# Altium schematic sheet CONNECTIONS.SchDoc: CONNECTIONS
size A4; DocumentNumber: 7; Revision: 1.9; SheetNumber: 7; SheetTotal: 18
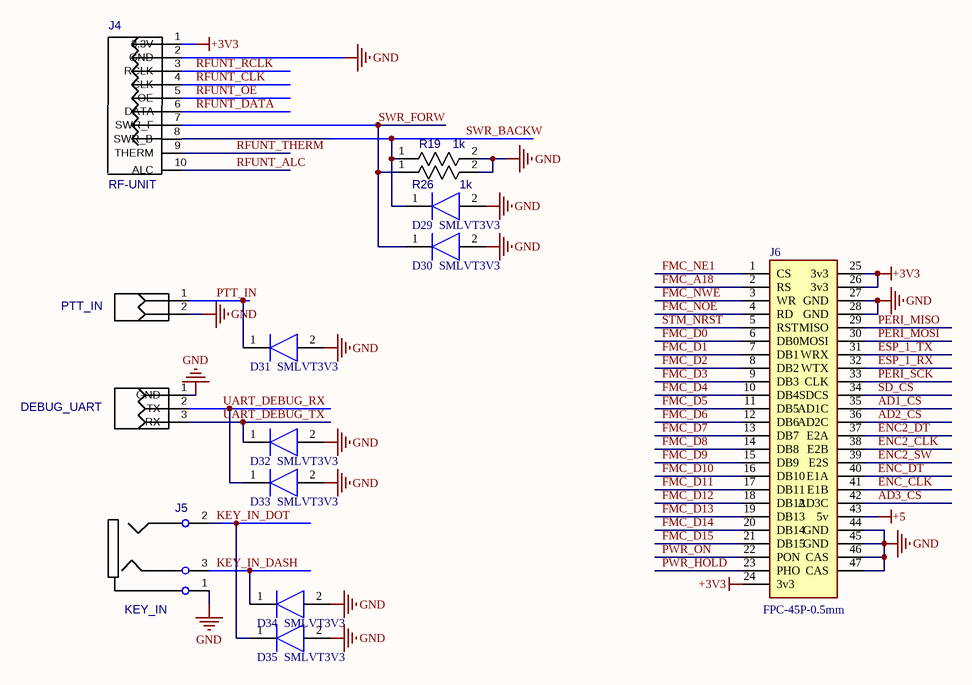
[diagram p0: CONNECTIONS.SchDoc]

## Parts
D29  SMLVT3V3  [SMBJ36CATR]
D30  SMLVT3V3  [SMBJ36CATR]
D31  SMLVT3V3  [SMBJ36CATR]
D32  SMLVT3V3  [SMBJ36CATR]
D33  SMLVT3V3  [SMBJ36CATR]
D34  SMLVT3V3  [SMBJ36CATR]
D35  SMLVT3V3  [SMBJ36CATR]
DEBUG_UART  DEBUG_UART  [51022-0300]  (value not drawn)
J4  RF-UNIT  [90131-0126]
J5  value KEY_IN  [SJ1-3523N]  (hidden comment: SJ1-3523N)
J6  FPC-45P-0.5mm  [FH12S45S05SH60]
PTT_IN  PTT_IN  [51022-0200]  (value not drawn)
R19  1k  [RES_0805]
R26  1k  [RES_0805]

## Nets
+3V3: J4.1(3.3V) J6.24(3v3) J6.25(3v3) J6.26(3v3)
+5: J6.43(5v)
GND: D29.2(A) D30.2(A) D31.2(A) D32.2(A) D33.2(A) D34.2(A) D35.2(A) DEBUG_UART.1(GND) J4.2(GND) J5.1(sleeve) J6.27(GND) J6.28(GND) J6.44(GND) J6.45(GND) J6.46(CAS) J6.47(CAS) PTT_IN.2 R19.2 R26.2
AD1_CS: J6.35(AD1C)
AD2_CS: J6.36(AD2C)
AD3_CS: J6.42(AD3C)
ENC2_CLK: J6.38(E2B)
ENC2_DT: J6.37(E2A)
ENC2_SW: J6.39(E2S)
ENC_CLK: J6.41(E1B)
ENC_DT: J6.40(E1A)
ESP_1_RX: J6.32(WTX)
ESP_1_TX: J6.31(WRX)
FMC_A18: J6.2(RS)
FMC_D0: J6.6(DB0)
FMC_D1: J6.7(DB1)
FMC_D2: J6.8(DB2)
FMC_D3: J6.9(DB3)
FMC_D4: J6.10(DB4)
FMC_D5: J6.11(DB5)
FMC_D6: J6.12(DB6)
FMC_D7: J6.13(DB7)
FMC_D8: J6.14(DB8)
FMC_D9: J6.15(DB9)
FMC_D10: J6.16(DB10)
FMC_D11: J6.17(DB11)
FMC_D12: J6.18(DB12)
FMC_D13: J6.19(DB13)
FMC_D14: J6.20(DB14)
FMC_D15: J6.21(DB15)
FMC_NE1: J6.1(CS)
FMC_NOE: J6.4(RD)
FMC_NWE: J6.3(WR)
KEY_IN_DASH: D34.1(K) J5.3(ring)
KEY_IN_DOT: D35.1(K) J5.2(tip)
PERI_MISO: J6.29(MISO)
PERI_MOSI: J6.30(MOSI)
PERI_SCK: J6.33(CLK)
PTT_IN: D31.1(K) PTT_IN.1
PWR_HOLD: J6.23(PHO)
PWR_ON: J6.22(PON)
RFUNT_ALC: J4.10(ALC)
RFUNT_CLK: J4.4(CLK)
RFUNT_DATA: J4.6(DATA)
RFUNT_OE: J4.5(OE)
RFUNT_RCLK: J4.3(RCLK)
RFUNT_THERM: J4.9(THERM)
SD_CS: J6.34(SDCS)
STM_NRST: J6.5(RST)
SWR_BACKW: D29.1(K) J4.8(SWR_B) R19.1
SWR_FORW: D30.1(K) J4.7(SWR_F) R26.1
UART_DEBUG_RX: D33.1(K) DEBUG_UART.2(TX)
UART_DEBUG_TX: D32.1(K) DEBUG_UART.3(RX)

## Notes on the sheet
- Title
- Size:
- Date:
- A4
- Number:
- Time:
- Revision:
- Sheet
- of
- File:

## Library data of the parts
D29-D35 = SMLVT3V3: Diode; Manufacturer_Name: STMicroelectronics; Allied_Number: 70013736; Datasheet Link: http://www.st.com/web/en/resource/technical/document/datasheet/CD00000923.pdf; Height: 2.65mm; Manufacturer_Part_Number: SMLVT3V3; Mouser Part Number: 511-SMLVT3V3; Mouser Price/Stock: https://www.mouser.com/Search/Refine.aspx?Keyword=511-SMLVT3V3; RS Part Number: 5444821P; RS Price/Stock: http://uk.rs-online.com/web/p/products/5444821P; Allied Price/Stock: http://www.alliedelec.com/stmicroelectronics-smlvt3v3/70013736/
DEBUG_UART = 51022-0300: 3 Pin
J4 = 90131-0126: 2*5 Pin; Value: *
J6 = FH12S-45S-0.5SH_55_: Connector; Manufacturer_Name: Hirose; Manufacturer_Part_Number: FH12S-45S-0.5SH(55); Datasheet Link: https://www.hirose.com/product/en/download_file/key_name/FH12S-45S-0.5SH%2855%29/category/Drawing%20(2D)/doc_file_id/43881/?file_category_id=6&item_id=05860665055&is_series=; Height: 2mm; Mouser Part Number: 798-FH12S-45S-05SH55; Mouser Price/Stock: https://www.mouser.co.uk/ProductDetail/Hirose-Connector/FH12S-45S-05SH55?qs=0N%252BVULUZFj%252BE0LA99Ny0NA%3D%3D; RS Part Number: 1620942; RS Price/Stock: http://uk.rs-online.com/web/p/products/1620942
PTT_IN = 51022-0200
R19 R26 = RES_0805: Value: 1k